# EAGLE design Adafruit Feather M4 Express (EAGLE 9.0.1)
COMPANY: ADAFRUIT INDUSTRIES; DRAWN: KTOWN; REV: B
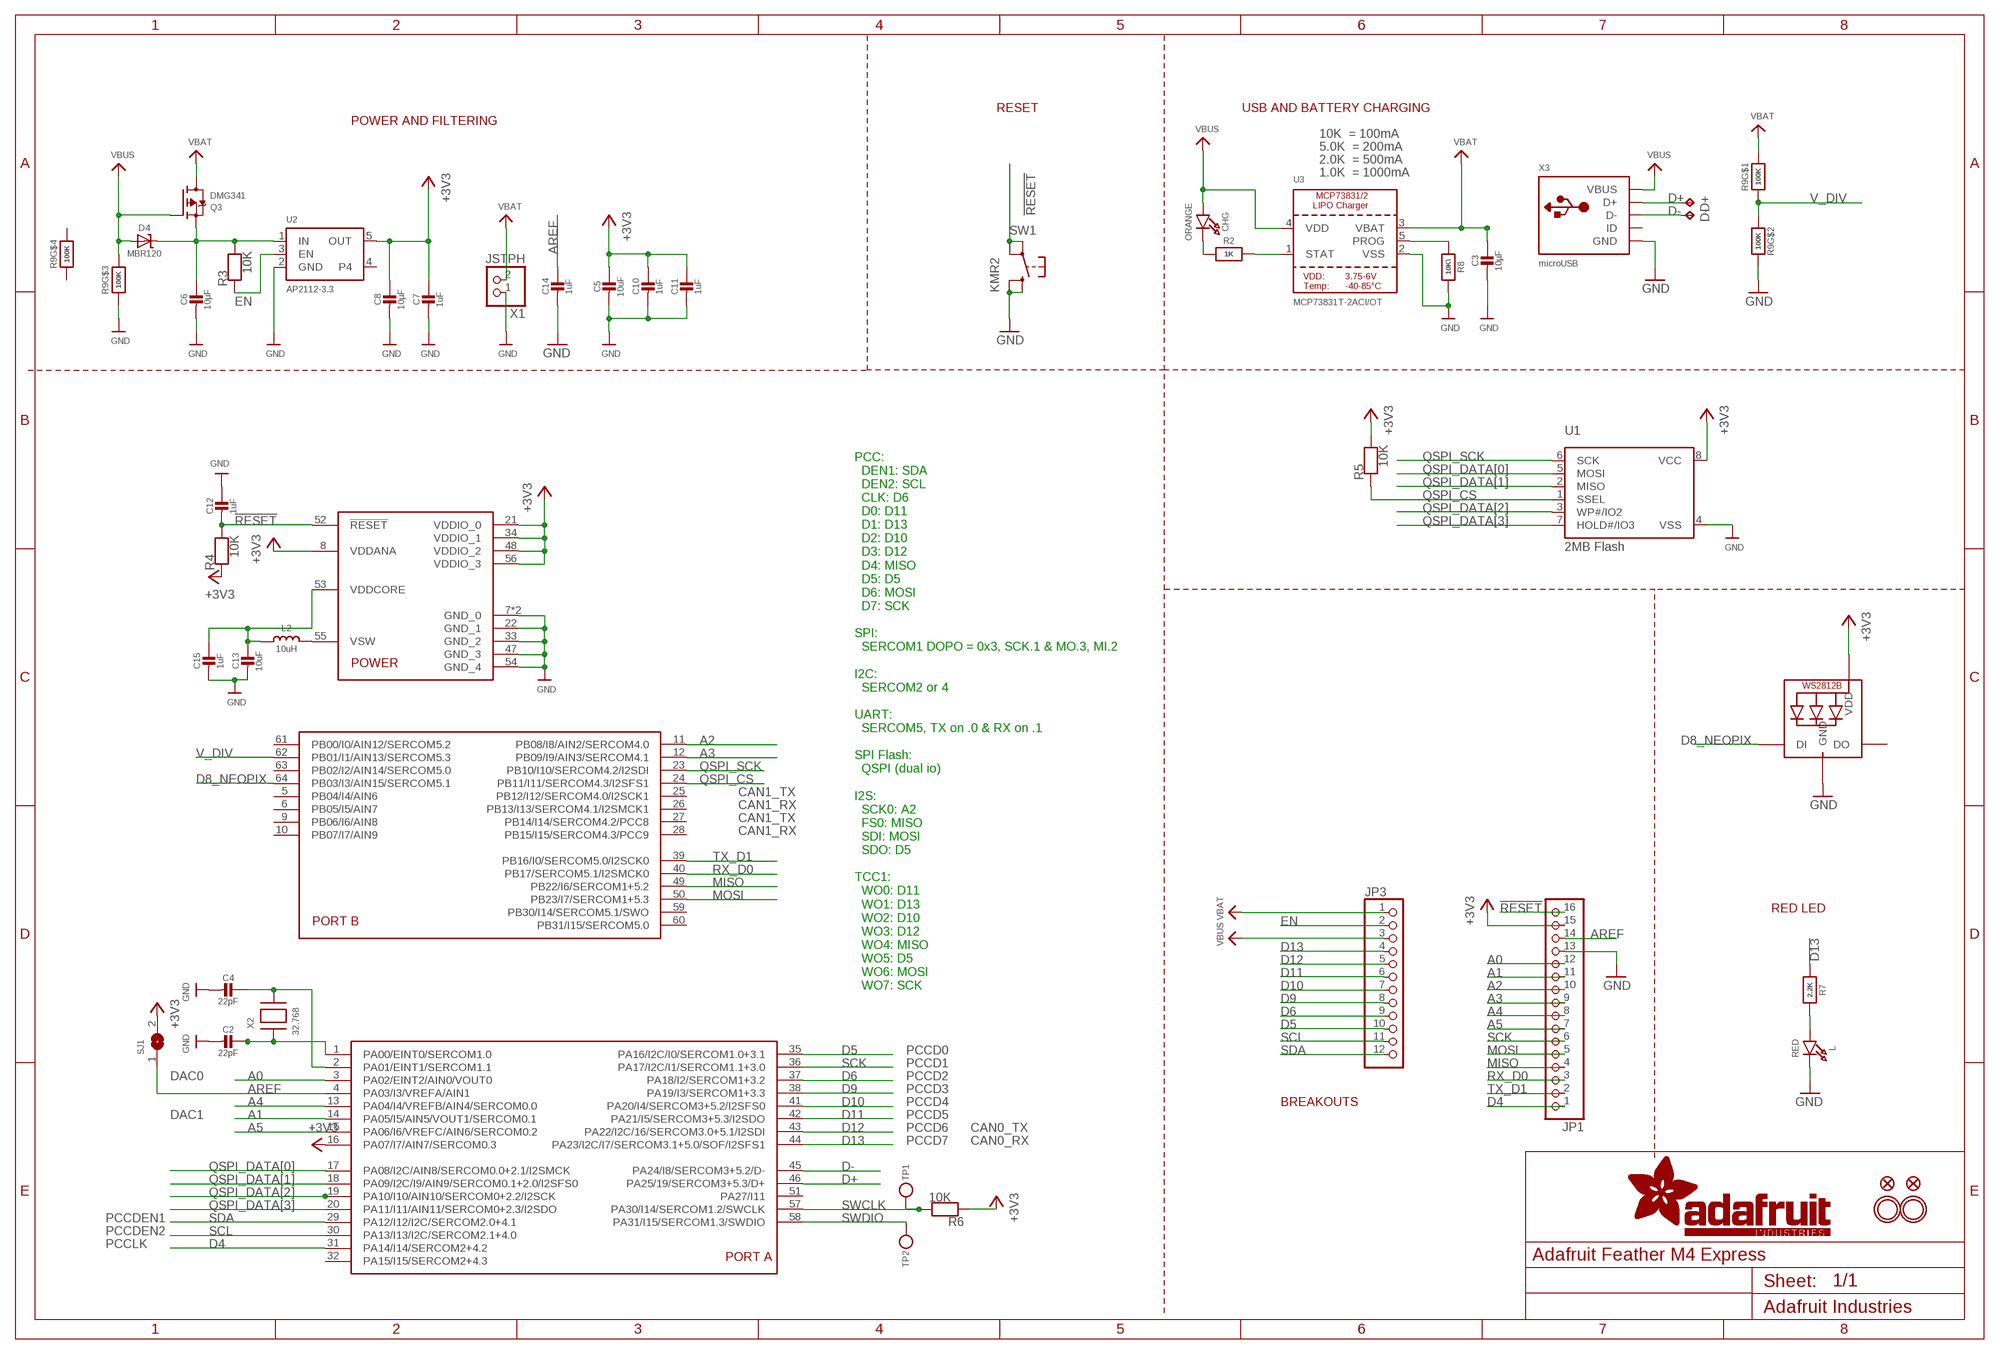
[diagram p0: schematic, sheet 1]

## Parts
C2  22pF  CAP_CERAMIC0603_NO  [0603-NO]
C3  10µF  CAP_CERAMIC0805-NOOUTLINE  [0805-NO]
C4  22pF  CAP_CERAMIC0603_NO  [0603-NO]
C5  10uF  CAP_CERAMIC0805-NOOUTLINE  [0805-NO]
C6  10µF  CAP_CERAMIC0805-NOOUTLINE  [0805-NO]
C7  1uF  CAP_CERAMIC0603_NO  [0603-NO]
C8  10µF  CAP_CERAMIC0805-NOOUTLINE  [0805-NO]
C10  1uF  CAP_CERAMIC0603_NO  [0603-NO]
C11  1uF  CAP_CERAMIC0603_NO  [0603-NO]
C12  1uF  CAP_CERAMIC0603_NO  [0603-NO]
C13  10uF  CAP_CERAMIC0805-NOOUTLINE  [0805-NO]
C14  1uF  CAP_CERAMIC0603_NO  [0603-NO]
C15  1uF  CAP_CERAMIC0603_NO  [0603-NO]
CHG  ORANGE  LED0805_NOOUTLINE  [CHIPLED_0805_NOOUTLINE]
D4  MBR120  DIODE-SCHOTTKYSOD-123  [SOD-123]
D+  TPB1,27  [B1,27]
D-  TPB1,27  [B1,27]
JP1  HEADER-1X16ROUND  [1X16_ROUND]
JP3  HEADER-1X12  [1X12_ROUND]
L  RED  LED0805_NOOUTLINE  [CHIPLED_0805_NOOUTLINE]
L2  10uH  INDUCTOR  [INDUCTOR_1007]
LED1  WS2812B3535  [LED3535]
Q3  DMG341  MOSFET-P  [SOT23-R]
R2  1K  RESISTOR_0603_NOOUT  [0603-NO]
R3  10K  RESISTOR_0603_NOOUT  [0603-NO]
R4  10K  RESISTOR_0603_NOOUT  [0603-NO]
R5  10K  RESISTOR_0603_NOOUT  [0603-NO]
R6  10K  RESISTOR_0603_NOOUT  [0603-NO]
R7  2.2K  RESISTOR_0603_NOOUT  [0603-NO]
R8  10K\  RESISTOR_0603_NOOUT  [0603-NO]
R9  100K  RESISTOR_4PACK_NO  [RESPACK_4X0603_NO]
SJ1  SOLDERJUMPERCLOSED  [SOLDERJUMPER_CLOSEDWIRE]
SW1  KMR2  SWITCH_TACT_SMT4.6X2.8  [BTN_KMR2_4.6X2.8]
TP1  TESTPOINTROUND1.5MM  [TESTPOINT_ROUND_1.5MM]
TP2  TESTPOINTROUND1.5MM  [TESTPOINT_ROUND_1.5MM]
U1  2MB Flash  SPIFLASH_8PINUX  [USON8]
U2  AP2112-3.3  VREG_SOT23-5  [SOT23-5]
U3  MCP73831T-2ACI/OT  MCP73831/2  [SOT23-5]
U$14  ATSAMD51J  [PQFN64-1]
U$31  MOUNTINGHOLE2.5  [MOUNTINGHOLE_2.5_PLATED]
U$32  MOUNTINGHOLE2.5  [MOUNTINGHOLE_2.5_PLATED]
U$34  FIDUCIAL_1MM  [FIDUCIAL_1MM]
U$35  FIDUCIAL_1MM  [FIDUCIAL_1MM]
X1  JSTPH  CON_JST_PH_2PIN  [JSTPH2]
X2  32.768  XTAL-3.2X1.5  [XTAL3215]
X3  microUSB  USB_MICRO_20329_V2  [4UCONN_20329_V2]

## Nets
!RESET: C12.2 JP1.16 R4.2 SW1.A'(P1) SW1.A(P) U$14.52(!RESET)
+3V3 [power]: C5.1 C7.1 C8.1 C10.1 C11.1 JP1.15 LED1.2(VDD) R4.1 R5.2 R6.1 SJ1.2 U1.8(VCC) U2.5(OUT) U$14.8(VDDANA) U$14.16(PA07/I7/AIN7/SERCOM0.3) U$14.21(VDDIO_0) U$14.34(VDDIO_1) U$14.48(VDDIO_2) U$14.56(VDDIO_3)
A0: JP1.12 U$14.3(PA02/EINT2/AIN0/VOUT0)
A1: JP1.11 U$14.14(PA05/I5/AIN5/VOUT1/SERCOM0.1)
A2: JP1.10 U$14.11(PB08/I8/AIN2/SERCOM4.0)
A3: JP1.9 U$14.12(PB09/I9/AIN3/SERCOM4.1)
A4: JP1.8 U$14.13(PA04/I4/VREFB/AIN4/SERCOM0.0)
A5: JP1.7 U$14.15(PA06/I6/VREFC/AIN6/SERCOM0.2)
AREF: C14.1 JP1.14 SJ1.1 U$14.4(PA03/I3/VREFA/AIN1)
D4: JP1.1 U$14.31(PA14/I14/SERCOM2+4.2)
D5: JP3.10 U$14.35(PA16/I2C/I0/SERCOM1.0+3.1)
D6: JP3.9 U$14.37(PA18/I2/SERCOM1+3.2)
D8_NEOPIX: LED1.1(DI) U$14.64(PB03/I3/AIN15/SERCOM5.1)
D9: JP3.8 U$14.38(PA19/I3/SERCOM1+3.3)
D10: JP3.7 U$14.41(PA20/I4/SERCOM3+5.2/I2SFS0)
D11: JP3.6 U$14.42(PA21/I5/SERCOM3+5.3/I2SDO)
D12: JP3.5 U$14.43(PA22/I2C/16/SERCOM3.0+5.1/I2SDI)
D13: JP3.4 R7.1 U$14.44(PA23/I2C/I7/SERCOM3.1+5.0/SOF/I2SFS1)
D+: D+.TP U$14.46(PA25/19/SERCOM3+5.3/D+) X3.D+
D-: D-.TP U$14.45(PA24/I8/SERCOM3+5.2/D-) X3.D-
EN: JP3.2 R3.1 U2.3(EN)
GND [gnd]: C2.2 C3.2 C4.2 C5.2 C6.2 C7.2 C8.2 C10.2 C11.2 C12.1 C13.2 C14.2 C15.2 JP1.13 L.C LED1.4(GND) R8.2 R9.3 R9.7 SW1.B'(S1) SW1.B(S) U1.4(VSS) U2.2(GND) U3.2(VSS) U$14.7(GND_0) U$14.22(GND_1) U$14.33(GND_2) U$14.47(GND_3) U$14.54(GND_4) U$14.EXP(GND_0) X1.1 X3.BASE@1(GND) X3.BASE@2(GND) X3.GND X3.SPRT@1(GND) X3.SPRT@2(GND) X3.SPRT@3(GND) X3.SPRT@4(GND)
MISO: JP1.4 U$14.49(PB22/I6/SERCOM1+5.2)
MOSI: JP1.5 U$14.50(PB23/I7/SERCOM1+5.3)
N$1: CHG.C R2.1
N$2: L.A R7.2
N$3: R2.2 U3.1(STAT)
N$4: R8.1 U3.5(PROG)
N$5: C2.1 U$14.1(PA00/EINT0/SERCOM1.0) X2.P$1
N$7: C4.1 U$14.2(PA01/EINT1/SERCOM1.1) X2.P$2
N$11: L2.P$2 U$14.55(VSW)
QSPI_CS: R5.1 U1.1(SSEL) U$14.24(PB11/I11/SERCOM4.3/I2SFS1)
QSPI_DATA[0]: U1.5(MOSI) U$14.17(PA08/I2C/AIN8/SERCOM0.0+2.1/I2SMCK)
QSPI_DATA[1]: U1.2(MISO) U$14.18(PA09/I2C/I9/AIN9/SERCOM0.1+2.0/I2SFS0)
QSPI_DATA[2]: U1.3(WP#/IO2) U$14.19(PA10/I10/AIN10/SERCOM0+2.2/I2SCK)
QSPI_DATA[3]: U1.7(HOLD#/IO3) U$14.20(PA11/I11/AIN11/SERCOM0+2.3/I2SDO)
QSPI_SCK: U1.6(SCK) U$14.23(PB10/I10/SERCOM4.2/I2SDI)
RX_D0: JP1.3 U$14.40(PB17/SERCOM5.1/I2SMCK0)
SCK: JP1.6 U$14.36(PA17/I2C/I1/SERCOM1.1+3.0)
SCL: JP3.11 U$14.30(PA13/I13/I2C/SERCOM2.1+4.0)
SDA: JP3.12 U$14.29(PA12/I12/I2C/SERCOM2.0+4.1)
SWCLK: R6.2 TP1.P$1 U$14.57(PA30/I14/SERCOM1.2/SWCLK)
SWDIO: TP2.P$1 U$14.58(PA31/I15/SERCOM1.3/SWDIO)
TX_D1: JP1.2 U$14.39(PB16/I0/SERCOM5.0/I2SCK0)
V_DIV: R9.1 R9.2 U$14.62(PB01/I1/AIN13/SERCOM5.3)
VBAT [power]: C3.1 JP3.1 Q3.3(D) R9.8 U3.3(VBAT) X1.2
VBUS [power]: CHG.A D4.A JP3.3 Q3.1(G) R9.6 U3.4(VDD) X3.VBUS
VDDCORE1: C13.1 C15.1 L2.P$1 U$14.53(VDDCORE)
VHI: C6.1 D4.C Q3.2(S) R3.2 U2.1(IN)
Unconnected: LED1.3(DO) R9.4 R9.5 U2.4 U$14.5(PB04/I4/AIN6) U$14.6(PB05/I5/AIN7) U$14.9(PB06/I6/AIN8) U$14.10(PB07/I7/AIN9) U$14.25(PB12/I12/SERCOM4.0/I2SCK1) U$14.26(PB13/I13/SERCOM4.1/I2SMCK1) U$14.27(PB14/I14/SERCOM4.2/PCC8) U$14.28(PB15/I15/SERCOM4.3/PCC9) U$14.32(PA15/I15/SERCOM2+4.3) U$14.51(PA27/I11) U$14.59(PB30/I14/SERCOM5.1/SWO) U$14.60(PB31/I15/SERCOM5.0) U$14.61(PB00/I0/AIN12/SERCOM5.2) U$14.63(PB02/I2/AIN14/SERCOM5.0) X3.ID

## Notes on the sheet
- RESET | USB AND BATTERY CHARGING
- POWER AND FILTERING
- 10K  = 100mA
- 5.0K  = 200mA
- 2.0K  = 500mA
- 1.0K  = 1000mA
- CAN1_TX
- CAN1_RX
- CAN1_TX
- CAN1_RX
- RED LED
- PCC:
    DEN1: SDA
    DEN2: SCL
    CLK: D6
    D0: D11
    D1: D13
    D2: D10
    D3: D12
    D4: MISO
    D5: D5
    D6: MOSI
    D7: SCK
  
  SPI:
    SERCOM1 DOPO = 0x3, SCK.1 & MO.3, MI.2
  
  I2C:
    SERCOM2 or 4
  
  UART:
    SERCOM5, TX on .0 & RX on .1
  
  SPI Flash:
    QSPI (dual io)
  
  I2S:
    SCK0: A2
    FS0: MISO
    SDI: MOSI
    SDO: D5
  
  TCC1:
    WO0: D11
    WO1: D13
    WO2: D10
    WO3: D12
    WO4: MISO
    WO5: D5
    WO6: MOSI
    WO7: SCK
- PCCD0
- PCCD1
- DAC0 | PCCD2
- PCCD3
- PCCD4 | BREAKOUTS
- DAC1 | PCCD5
- PCCD6 | CAN0_TX
- PCCD7 | CAN0_RX
- PCCDEN1
- PCCDEN2
- PCCLK

## Library data of the parts
C2-C8 C10-C15 = microbuilder:CAP_CERAMIC: Ceramic Capacitors For new designs, use the packages preceded by an '_' character since they are more reliable: The following footprints should be used on most boards: _0402 - Standard footprint for regular board layouts _0603 - Standard footprint for regular board layouts _0805 - Standard footprint for regular board layouts _1206 - Standard footprint for regular board layouts For extremely tight-pitch boards where space is at a premium, the following 'micro-pitch' footprints can be used (smaller pads, no silkscreen outline, etc.): _0402MP - Micro-pitch footprint for very dense/compact boards _0603MP - Micro-pitch footprint for very dense/compact boards _0805MP - Micro-pitch footprint for very dense/compact boards _1206MP - Micro-pitch footprint for very dense/compact boards
CHG L = microbuilder:LED: LED 0603 - 0603 Surface Mount Package 2mA: Green LED - Low Power (3.9mcd, 2ma, 1.7Vf) - Digikey: 475-2709-2-ND Orange LED - Low Power (9.8mcd, 2ma, 1.8Vf) - Digikey: 475-1194-2-ND Red LED - Low Power (5mcd, 2ma, 1.8Vf) - Digikey: 475-1195-2-ND Yellow LED - Low Power (7mcd, 2ma, 1.8Vf) - Digikey: 475-1196-2-ND 5mA: Blue LED - Low Power (17mcd, 5ma, 2.9Vf) - Digikey: LNJ937W8CRACT-ND 0805 - 0805 Surface Mount Package 2mA: Red LED (8.8mcd, 2mA, 1.8Vf, Clear) - Low Power [Digikey: 475-2510-1-ND] Green LED (5mcd, 2mA, 1.8Vf, Clear) - Low Power [Digikey: 475-2730-1-ND] Yellow LED (11.3mcd, 2mA, 1.8Vf, Clear) - Low Power [Digikey: 475-2555-1-ND] 20mA: Red LED (104mcd, 20mA, Diffused) - LS R976 [Digikey: 475-1278-6-ND] Red LED (12mcd, 20mA, 2.0Vf, Clear) - APT2012EC [Digikey: 754-1128-1-ND] Green LED (15mcd, 20mA, 2.2Vf, Clear) - APT2012GC [Digikey: 754-1131-1-ND] Orange LED (160mcd, 20mA, 2.1Vf, Clear) - APT2012SECK [Digikey: 754-1130-1-ND] 1206 - 1206 Surface Mount Package Green LED (26mcd, 20mA, Diffused) - LG N971 [Digikey: 475-1407-6-ND] Red LED (15mcd, 20mA, Diffused) - LH N974 [Digikey: 475-1416-6-ND] Cree - Cree High-Power Surface Mount LEDs XPEBWT-L1-0000-00D50 - White 111lm 350mA 2.9Vf 6200K 110° XTEAWT-00-0000-00000LEE3 - White 114lm 350mA 2.85Vf 5000K 115° Everlight - Everlight 45-21 Series Surface Mount LEDs 45-21/QK2C-B2832AC2CB2/2T - Warm White 2000mcd 20mA 3.25Vf 3050K 120° 45-21/LK2C-B38452C4CB2/2T - Nuetral White 2000mcd 20mA 3.25Vf 4150K 120° 45-21/LK2C-B50634C6CB2/2T - Cold White 2200mcd 20mA 3.25Vf 5650K 120° PLCC2 Reverse Mount LS T77K-J1L2-1-0-2-R18-Z - Red 11.25mcd 2mA 1.8Vf 630nm 120° LO T77K-L1M2-24-Z - Orange 19.6mcd 2mA 1.8Vf 606nm 120° LY T77K-K2M1-26-Z - Yellow 15.7mcd 2mA 1.8Vf 587nm 120°
D4 = microbuilder:DIODE-SCHOTTKY
D+ D- = testpad:TP: Test pad
JP1 = microbuilder:HEADER-1X16: PIN HEADER
JP3 = microbuilder:HEADER-1X12
L2 = microbuilder:INDUCTOR: Inductors 0603: 10nH Ceramic Inductor - microwire antenna/RF (Digikey: 712-1434-2-ND) 0805: 560nH Ceramic Inductor - RF (Digikey: 553-1047-1-ND) 270nH Ceramic Inductor - Q = 40@250MHz, +-5%, 1 Ohm DC Resistance (Digikey: 535-10506-2-ND) 1007 (2518 Metric) SMT: 10µH 10% 250mOhm 820mA 1007 Inductor (Digikey: 587-2189-1-ND) 22µH 10% 500mOhm 580mA 1007 Inductor (Digikey: 587-2190-1-ND) 47µH 10% 950mOhm 420mA 1007 Inductor (Digikey: 587-2191-1-ND) 47µH 5% 100mOhm 1A 1008 Inductor (Digikey: 732-1816-1-ND) 5.0x5.0mm (Taiyo Yuden NR5040 Series) 6.8µH 20% 2.3A 64mOhm Inductor (Digikey: 587-2374-2-ND) 5.0x5.0mm (TDK VLC5045 Series) 4.7µH 20% 3.3A 34mOhm Inductor (Digikey: 445-6526-1-ND) 6.8µH 20% 2.7A 46mOhm Inductor (Digikey: 445-6527-1-ND) 6.0x6.0mm (TDK VLC6045 Series) 4.7µH 20% 3.8A 27mOhm Inductor (Digikey: 445-6538-2-ND) 6.8µH 20% 3A 41mOhm Inductor (Digikey: 445-6540-1-ND) 6.2µH 30% 2.2A 45mOhm Inductor (Digikey: SRR5028-6R2YCT-ND) - Not TDK VLC6045 but footprint should match 6.0x6.0mm (TDK SLF6045 Series) 6.8uH 30% 2A 33mOhm Inductor (Digikey: 445-4572-1-ND, Mouser: 810-SLF645T6R8N2R0PF) 6.0x6.0mm (Sumida CDRH5D28 Series) 6.2uH 30% 1.8A 45mOhm Inductor (Digikey: 308-1542-1-ND) Taiyo Yuden NR3015T2R2M - 2.2uH 20% 1.5A (Digikey: 587-1648-2-ND, Mouser: 963-NR3015T2R2M) - Used with TI TPS62172 CoilCraft RFID Transponder Coil - MA5532-AE (For use with AS3935 Lightning Sensor) Taiyo Yuden NRH2412T2R2MNGH - 2.2uH 20% 1AA (Digikey: 587-3443-1-ND) - Used with TI LM3671 Vishay IHLP 1.0uH Molded Inductor - 24mOhm DCR, 5A, +/-20%, -55°C-125°C (Digikey: 541-1319-1-ND)
LED1 = microbuilder:WS2812B
Q3 = microbuilder:MOSFET-P: P-Channel Mosfet LEGEND VDS: Voltage Drain-Source ID: Drain Current RDS(ON): Drain-Source On-State Resistance VGS(TH): Gate-Source Threshold Voltage CISS: Drain-Source Input Capacitance SOT-23 Name VDS ID RDS(ON) VGS(TH) CISS Order Number IRLML5103 30V 760mA 600 mOhm -- 75pF @ 25V Digikey: IRLML5103PBFCT-ND IRLML6401 12V 4.3A 50 mOhm 950mV @ 250µA 830pF @ 10V Digikey: IRLML6401PBFTR-ND NTR0202PL 20V 400mA 800 mOhm 2.3V @ 250uA 70pF @ 5V Digikey: NTR0202PLT1GOSTR-ND NTR4101PT1G 20V 1.8A 85 mOhm 1.2V @ 250uA 675pF @ 10V Digikey: NTR4101PT1GOSCT-ND DMP2004K 20V 600mA 900 mOhm 1V @ 250uA 175pF @ 16V Digikey: DMP2004KDICT-ND PMV65XP 20V 3.9A 76 mOhm 950mV @ 1mA 725pF @ 20V Digikey: 568-2358-2-ND TO-252 Name VDS ID RDS(ON) VGS(TH) CISS Order Number AOD417 30V 25A 34 mOhm 3V @ 250µA 920pF @ 15V Digikey: 785-1106-2-ND PowerPak Name VDS ID RDS(ON) VGS(TH) CISS Order Number AON7401 30V 12A 14 mOhm 3V @ 250µA 2600pF @ 15V Digikey: 785-1302-1-ND
R2-R8 = microbuilder:RESISTOR: Resistors For new designs, use the packages preceded by an '_' character since they are more reliable: The following footprints should be used on most boards: _0402 - Standard footprint for regular board layouts _0603 - Standard footprint for regular board layouts _0805 - Standard footprint for regular board layouts _1206 - Standard footprint for regular board layouts For extremely tight-pitch boards where space is at a premium, the following 'micro-pitch' footprints can be used (smaller pads, no silkscreen outline, etc.): _0402MP - Micro-pitch footprint for very dense/compact boards _0603MP - Micro-pitch footprint for very dense/compact boards _0805MP - Micro-pitch footprint for very dense/compact boards _1206MP - Micro-pitch footprint for very dense/compact boards
R9 = microbuilder:RESISTOR_4PACK: Resistor Packs (4 resistors) 4 x 0603 10K 1/16W - Digikey: YC164J-10KCT-ND
SJ1 = microbuilder:SOLDERJUMPER: SMD Solder JUMPER Solder the two pads together to create a connection, or remove the solder to break it. REFLOW - Use this footprint for solder paste and reflow ovens. WAVE - Use this footprint for hand-soldering (larger pads). CLOSED - Has a trace between the two pads to ensure it is closed by default. The trace needs to be cut to disable the jumper, and can be closed again by creating a solder bridge between the two pads.
SW1 = microbuilder:SWITCH_TACT_SMT: SMT Tact Switches 6x6mm - Digikey: P12940SCT-ND KMR2 (4.6x2.8mm) - Digikey: 401-1426-1-ND EVQ-PQHB55 - Light Touch, 160GF (4.5x4.5mm) - Digikey: P8090SCT-ND KMT0 - KMT021 NGJ LHS (etc.) IP68/Waterproof - Digikey: CKN10289CT-ND
TP1 TP2 = microbuilder:TESTPOINT: Test Point Various test points for characterisation and PCB testing TESTPOINT_SMT - Compact Surface Mount Test Point [Digikey: 5016KTR-ND]
U1 = microbuilder:SPIFLASH_8PIN: SOIC8 SPI Flash Be careful with the size since SOIC8 flash comes in several 'widths' SOIC8 150 mil M25P16 - 16Mbit (2Mbit x 8) Serial Flash (75MHz SPI Bus), Supply: 2.7-3.6V Digikey: SOIC8 - M25P16-VMN6P-ND SOIC8 208 mil W25Q16BVSSIG - 16Mbit (2Mbit x 8) Serial Flash (104MHz SPI Bus), Supply: 2.7-3.6V Digikey: SOIC8 - W25Q16BVSSIG-ND
U2 = microbuilder:VREG_SOT23-5: SOT23-5 Fixed Voltage Regulators Part Current Out V Out V In V Dropout θJA (°C/W) TJ (°C) Digikey Part No. ADP121 150mA 3.3V 3.4-5.5V 0.09V @ 150mA -- -- ADP121-AUJZ33R7CT-ND ADP121 150mA 3.0V 3.1-5.5V 0.09V @ 150mA -- -- ADP121-AUJZ30R7CT-ND ADP122 300mA 3.3V 3.4-5.5V 0.085V @ 300mA -- -- ADP122AUJZ-3.3-R7CT-ND ADP1712 300mA 3.3V 3.5-5.5V 0.17V @ 300mA -- -- ADP1712AUJZ-3.3-R7TR-ND AP7311 (Low Cost) 150mA 3.3V 3.5-6V 0.15V @ 150mA -- -- AP7311-33WG-7DICT-ND LD39015M18R 150mA 1.8V 1.9V-5.5V 0.08V @ 100mA -- -- 497-6977-1-ND LP2985A-33DBVR 150mA 3.3V 3.3-16V 0.28V @ 150mA 206 150 296-18479-1-ND MCP1824T-3302E/OT 300mA 3.3V 3.5V-6V 0.2V @ 300mA -- -- MCP1824T-3302E/OTCT-ND MIC5205-2.5YM5 TR 150mA 2.5V 2.7-16V 0.165V @ 150mA -- -- 576-1257-2-ND MIC5205-3.0YM5 TR 150mA 3.0V 3.2V-16V 0.165V @ 150mA -- -- 576-1258-2-ND MIC5205-3.3YM5 TR 150mA 3.3V 3.5V-16V 0.165V @ 150mA -- -- 576-1259-2-ND TPS780330220 150mA 3.3V+2.2V 3.6-5.5V 250mV Max -- -- 296-23332-1-ND TDA3663/N1,135 100mA 3.3V 3.5-45V 0.18V @ 50mA -- -- 568-5343-1-ND Max operating temp can be calculated using θJA, TJ (max junction temperature), and power in watts. Set the "Maximum Ambient Temperature" until it reaches TJ ("Max Junction Temperature"), which is the absolute limit for safe use of the regulator: Heat Sink Temperature Calculator <http://www.daycounter.com/Calculators/Heat-Sink-Temperature-Calculator.phtml> For example, With 12V source into a 3.3V LP2985 and a 30mA load, we are dissipating (12V-3.3V) * 0.03A = 0.261W. With a θJA of 206 °C/W, a TJ of 150°C, and 261mW we can safely use the chip without a heat sink up to 75°C (=147.1°C Junction Temperature).
U3 = microbuilder:MCP73831/2: MCP73831/2 LIPO Charger VDD: 3.75 - 6V Temp -40 - 85°C Programmable Charge Rate: 15-500mA NOTE: STAT is a tri-state logic output on the MCP73831 and an open-drain output on the MCP73832. SOT23-5 with 4.2V output and tri-state logic on STAT = MCP73831T-2ACI/OT
U$14 = microbuilder:ATSAMD51J: ATSAMD51J cortex m4 microcontroller
U$31 U$32 = microbuilder:MOUNTINGHOLE: Mounting Hole For #2 screws (0.086"/2.18mm width, 0.094"/2.4mm hole) use 2.5mm; BOM: EXCLUDE
U$34 U$35 = microbuilder:FIDUCIAL: Fiducial Alignment Points Various fiducial points for machine vision alignment.; BOM: EXCLUDE
X1 = microbuilder:CON_JST_PH_2PIN: JST 2-Pin Right-Angle Connector PH-Series - 4UConnector: 17311 SH-Series - 4UConnector: 07278
X2 = adafruit2:XTAL: Low cost SMT crystals, no capacitors included http://www.ladyada.net/library/eagle
X3 = microbuilder:USB: USB Connectors USBMINIB - Surface Mount Female Mini-B USB Connector 4UConnector: 06564

## Net classes
1 power: width 0.305 mm
2 gnd: width 0.254 mm

## Board
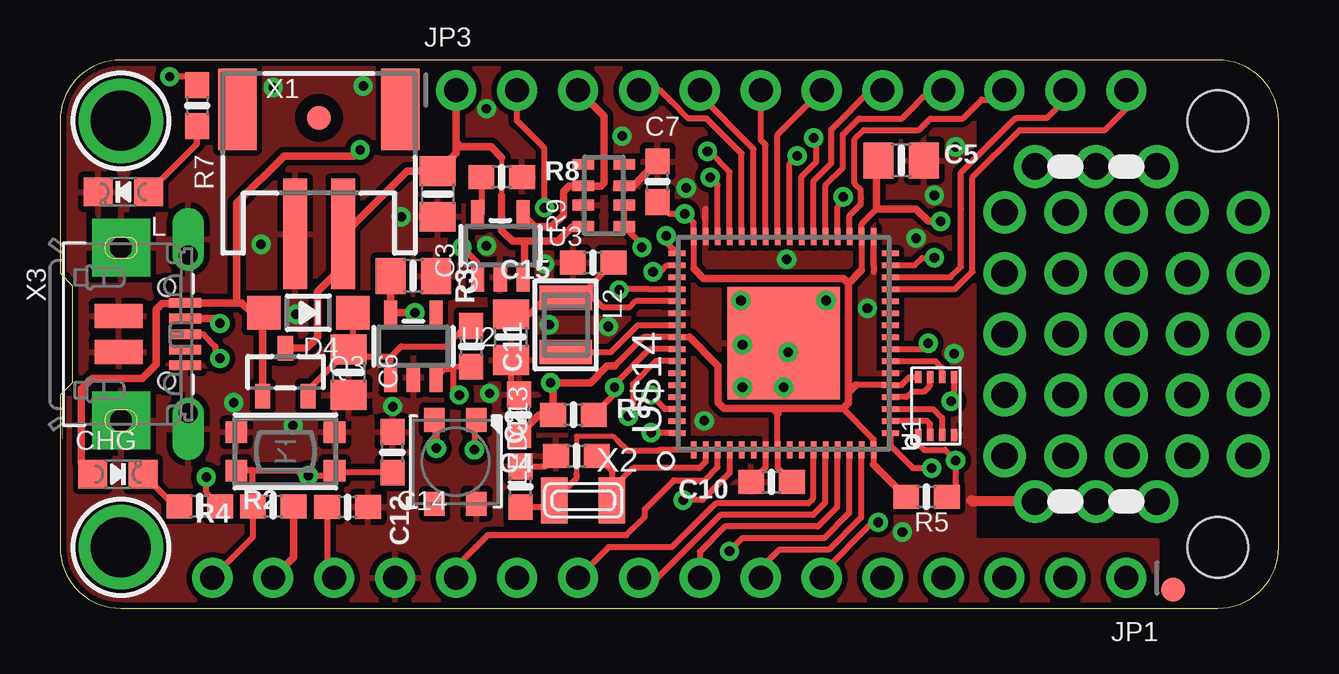
[diagram p1: board, top side]
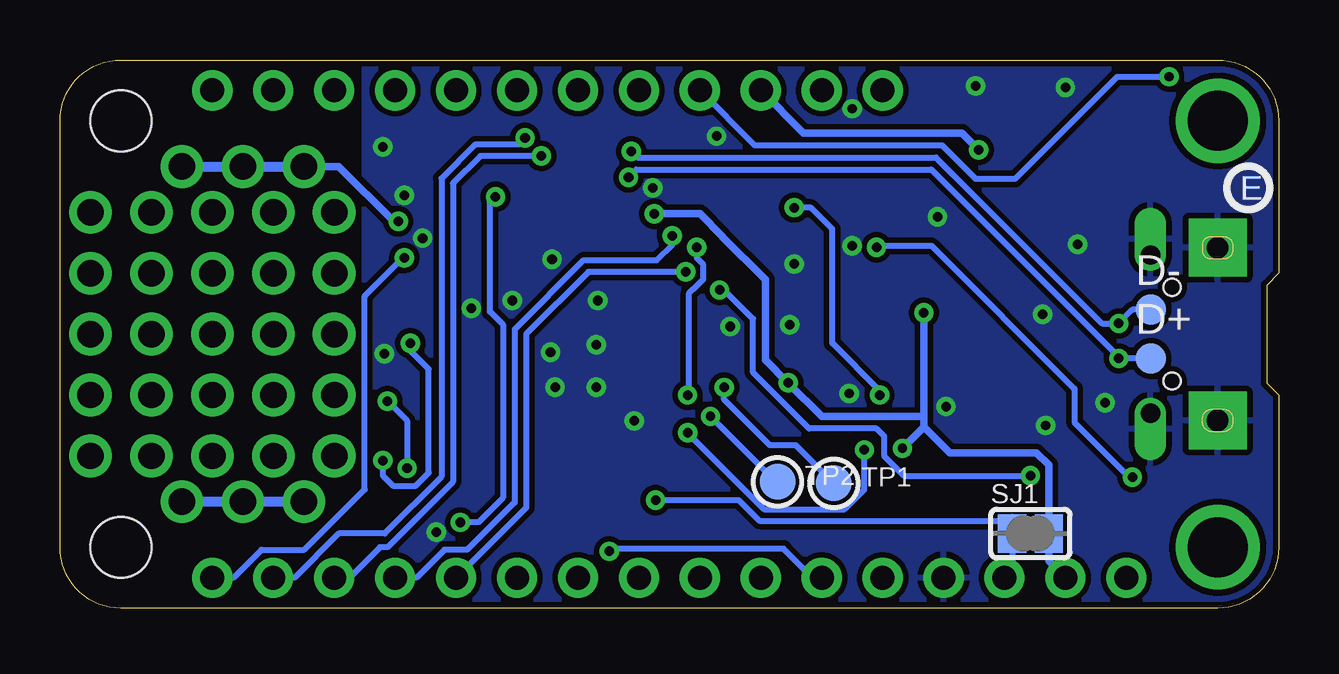
[diagram p2: board, bottom side, seen from below]

Size 50.8 x 22.86 mm. Coordinates in mm from the lower left corner, seen from the top.
Outline: 2.54,0 48.26,0 arc90 50.8,2.54 50.8,20.32 arc90 48.26,22.86 2.54,22.86 arc90 0,20.32 0,13.97 0.51,13.46 0.51,9.4 0,8.89 0,2.54 arc90 2.54,0
Copper layers (1*16): Top 0.035mm / dielectric 1.5mm / Bottom 0.035mm
Design rules "adafruit *": minimum track width 8mil, minimum drill 15.5mil, track to track 9mil, track to pad 8mil, pad to pad 8mil, via to via 8mil, smd to smd 8mil, copper to edge 10mil, drill to drill 8mil, minimum pad ring 10mil, minimum via ring 8mil, stop-mask expansion 2mil, vias tented up to drill 20mil, thermal gap 10mil
Holes 2.54 mm at 48.26,20.32 48.26,2.54

### Footprints (pad centres in the part's own frame; a part is rotated, then mirrored left to right if it is on the bottom)
0603-NO = smd 1.075 x 1: 1 -0.85,0; 2 0.85,0
0805-NO = smd 1.24 x 1.5: 1 -0.95,0; 2 0.95,0
CHIPLED_0805_NOOUTLINE = smd 1.2 x 1.2: A 0,-1.05; C 0,1.05
SOD-123 = smd 1.4 x 1.4: A 1.85,0; C -1.85,0
B1,27 = smd 1.27 x 1.27: TP 0,0
1X16_ROUND = drill 1 pad 1.676: 1 -19.05,0; 2 -16.51,0; 3 -13.97,0; 4 -11.43,0; 5 -8.89,0; 6 -6.35,0; 7 -3.81,0; 8 -1.27,0; 9 1.27,0; 10 3.81,0; 11 6.35,0; 12 8.89,0; 13 11.43,0; 14 13.97,0; 15 16.51,0; 16 19.05,0
1X12_ROUND = drill 1 pad 1.676: 1 -13.97,0; 2 -11.43,0; 3 -8.89,0; 4 -6.35,0; 5 -3.81,0; 6 -1.27,0; 7 1.27,0; 8 3.81,0; 9 6.35,0; 10 8.89,0; 11 11.43,0; 12 13.97,0
INDUCTOR_1007 = smd 1.016 x 2.2: P$1 -1.127,0; P$2 1.127,0
LED3535 = smd 1 x 0.85: 1 -1.75,0.875; 2 -1.75,-0.875; 3 1.75,-0.875; 4 1.75,0.875
SOT23-R = smd 0.635 x 1.016: 1 -0.95,-1; 2 0.95,-1; 3 0,1
RESPACK_4X0603_NO = smd 0.45 x 0.9: 1 -1.3,-0.85; 2 -0.4,-0.85; 3 0.4,-0.85; 4 1.3,-0.85; 5 1.3,0.85; 6 0.4,0.85; 7 -0.4,0.85; 8 -1.3,0.85
SOLDERJUMPER_CLOSEDWIRE = smd 1.168 x 1.6: 1 -0.762,0; 2 0.762,0 | smd 0.635 x 0.203: WIRE 0,0
BTN_KMR2_4.6X2.8 = smd 0.9 x 0.9: A 2.05,0.8; A' -2.05,0.8; B 2.05,-0.8; B' -2.05,-0.8
TESTPOINT_ROUND_1.5MM = smd 1.5 x 1.5: P$1 0,0
USON8 = smd 0.5 x 0.275: 1 -1.2,0.75; 2 -1.2,0.25; 3 -1.2,-0.25; 4 -1.2,-0.75; 5 1.2,-0.75; 6 1.2,-0.25; 7 1.2,0.25; 8 1.2,0.75
SOT23-5 = smd 0.55 x 1.2: 1 -0.95,-1.3; 2 0,-1.3; 3 0.95,-1.3; 4 0.95,1.3; 5 -0.95,1.3
PQFN64-1 = smd 0.7 x 0.22: 1 -4.45,3.75; 2 -4.45,3.25; 3 -4.45,2.75; 4 -4.45,2.25; 5 -4.45,1.75; 6 -4.45,1.25; 7 -4.45,0.75; 8 -4.45,0.25; 9 -4.45,-0.25; 10 -4.45,-0.75; 11 -4.45,-1.25; 12 -4.45,-1.75; 13 -4.45,-2.25; 14 -4.45,-2.75; 15 -4.45,-3.25; 16 -4.45,-3.75; 33 4.45,-3.75; 34 4.45,-3.25; 35 4.45,-2.75; 36 4.45,-2.25; 37 4.45,-1.75; 38 4.45,-1.25; 39 4.45,-0.75; 40 4.45,-0.25; 41 4.45,0.25; 42 4.45,0.75; 43 4.45,1.25; 44 4.45,1.75; 45 4.45,2.25; 46 4.45,2.75; 47 4.45,3.25; 48 4.45,3.75 | smd 0.22 x 0.7: 17 -3.75,-4.45; 18 -3.25,-4.45; 19 -2.75,-4.45; 20 -2.25,-4.45; 21 -1.75,-4.45; 22 -1.25,-4.45; 23 -0.75,-4.45; 24 -0.25,-4.45; 25 0.25,-4.45; 26 0.75,-4.45; 27 1.25,-4.45; 28 1.75,-4.45; 29 2.25,-4.45; 30 2.75,-4.45; 31 3.25,-4.45; 32 3.75,-4.45; 49 3.75,4.45; 50 3.25,4.45; 51 2.75,4.45; 52 2.25,4.45; 53 1.75,4.45; 54 1.25,4.45; 55 0.75,4.45; 56 0.25,4.45; 57 -0.25,4.45; 58 -0.75,4.45; 59 -1.25,4.45; 60 -1.75,4.45; 61 -2.25,4.45; 62 -2.75,4.45; 63 -3.25,4.45; 64 -3.75,4.45 | smd 4.7 x 4.7: EXP 0,0
MOUNTINGHOLE_2.5_PLATED = drill 2.5 pad 3.2: P$1 0,0
FIDUCIAL_1MM = smd 1 x 1: 1 0,0
JSTPH2 = smd 1 x 4.6: 1 -1,-3.7; 2 1,-3.7 | smd 1.6 x 3.4: NC1 -3.4,1.5; NC2 3.4,1.5
XTAL3215 = smd 1.1 x 1.9: P$1 1.2,0; P$2 -1.2,0
4UCONN_20329_V2 = smd 1 x 2: BASE@1 -0.75,-2; BASE@2 0.75,-2 | smd 0.4 x 1.35: D+ 0,0.775; D- -0.65,0.775; GND 1.3,0.775; ID 0.65,0.775; VBUS -1.3,0.775 | drill 0.8 pad 1.143 offset: SPRT@1 -3.3,0.9; SPRT@2 3.3,0.9 | drill 0.9 pad 2.413 square: SPRT@3 -3.6,-1.9; SPRT@4 3.6,-1.9 | hole 0.7: -1.95,0; 1.95,0

### Placement (x,y rotation side)
C2  19.2,5.07 90 top
C3  15.75,17.27 270 top
C4  21.53,6.35 180 top
C5  35.06,18.67 0 top
C6  12.04,9.84 270 top
C7  24.91,17.78 90 top
C8  14.73,13.86 0 top
C10  29.66,5.26 180 top
C11  19.13,8.06 90 top
C12  13.86,6.5 270 top
C13  18.8,11.3 270 top
C14  11.99,4.22 0 top
C15  22.23,14.41 180 top
CHG  2.41,5.59 270 top
D4  10.35,12.32 180 top
D+  5.33,10.41 0 bottom
D-  5.33,12.45 0 bottom
JP1  25.4,1.27 180 top
JP3  30.48,21.59 0 top
L  2.65,17.36 90 top
L2  21.08,11.81 270 top
LED1  16.48,6.11 270 top
Q3  9.4,9.84 0 top
R2  5.83,4.25 0 top
R3  17.14,10.92 90 top
R4  8.89,4.25 180 top
R5  36.12,4.65 180 top
R6  21.4,8.06 0 top
R7  5.71,20.95 270 top
R8  18.41,17.97 0 top
R9  22.67,17.21 90 top
SJ1  10.35,3.11 0 bottom
SW1  9.4,6.54 180 top
TP1  18.54,5.21 0 bottom
TP2  20.89,5.27 0 bottom
U1  36.51,8.43 90 top
U2  14.73,10.92 0 top
U3  18.35,15.11 0 top
U$5  [FEATHERM4_BOT]  50.8,0 0 bottom
U$6  [FEATHERM4_TOP]  0,0 0 top
U$13  [PCBFEAT-REV-040]  1.27,17.53 0 bottom
U$14  30.16,11.05 90 top
U$31  2.54,20.32 270 top
U$32  2.54,2.54 270 top
U$34  10.79,20.45 270 top
U$35  46.4,0.77 270 top
X1  10.79,19.3 0 top
X2  21.81,4.5 180 top
X3  4.45,11.43 270 top

### Tracks (layer width: path | path; a pad name or v marks a point on that pad's centre or on a via)
!RESET  (via drill 0.39)
  Top 0.254: 8.06,5.74 9.88,5.74 10.1,5.52 v10.35,5.52 11.23,5.52 SW1.A' 11.54,5.65 C12.2 | 8.06,5.74 SW1.A | JP1.16 8.04,2.96 R4.2 8.04,5.72 8.06,5.74 | v23.3,13.27 23.33,13.3 24.53,13.3 24.54,13.29 25.15,13.29 25.16,13.3 U$14.52
  Bottom 0.254: v23.3,13.27 23.11,13.27 21.91,12.06 21.91,9.83 19.57,7.49 16.76,7.49 16.45,7.18 16.45,6.35 15.62,5.52 v10.35,5.52
+3V3  (via drill 0.39, 0.4, 1.1 pad 1.78)
  Top 0.254: 23.11,10.09 24.32,11.3 U$14.56 26.23,11.3 | 34.04,16.64 33.41,16.01 U$14.34 33.41,14.09 | 33.17,9.3 U$14.21 35.08,9.3 35.41,9.63 U1.8 | 26.42,14.16 26.42,15.06 26.41,15.06 U$14.48 26.41,16.07 v26.04,16.45 25.39,16.45 C7.1 | 29.91,8.11 U$14.8 29.91,5.86 C10.1 | 32.63,8.32 33.91,7.04 U$14.16 33.91,6
  Top 0.305: R4.1 9.74,2.12 JP1.15 | C8.1 U2.5 | U2.5 | v14.8,12.32 13.87,12.32 U2.5 | v15.68,6.67 15.68,7.78 LED1.2 | 23.11,10.09 22.81,10.09 22.12,9.4 v20.45,9.4 20.55,9.3 R6.1 19.98,8.06 C11.1 | C5.1 34.04,18.59 34.04,16.64 35.69,16.64 36.19,16.14 v36.7,16.14 | 26.23,11.3 27.43,10.1 27.43,8.57 27.69,8.32 29.72,8.32 | 29.72,8.32 29.92,8.12 29.91,8.11 | 32.87,8.99 32.87,8.55 32.63,8.32 29.72,8.32 | 33.17,9.3 32.87,8.99 | 32.87,13.55 32.87,8.99 | 33.41,14.09 32.87,13.55 | 32.87,13.55 32.66,13.76 26.82,13.76 26.42,14.16 | 33.91,6 R5.2
  Bottom 0.305: JP1.15 9.59,1.97 SJ1.2 9.59,5.97 10.1,6.48 13.72,6.48 14.8,7.56 | 15.49,6.48 v15.68,6.67 14.8,7.56 | v14.8,12.32 14.8,8 | 14.8,7.56 14.8,8 | 14.8,8 19.05,8 v20.45,9.4 21.4,10.35 21.4,13.71 23.18,15.48 23.18,15.49 24.13,16.45 v26.04,16.45 | v40.64,18.41 39.18,18.41 36.9,16.14 v36.7,16.14
  Bottom 0.406: v45.72,18.41 v43.18,18.41 v40.64,18.41
A0
  Top 0.254: U$14.3 27.41,5.89 26.86,5.33 25.59,5.33 24.38,4.13 24.38,3.81 23.62,3.05 17.84,3.05 16.51,1.71 JP1.12
A1  (via drill 0.4)
  Top 0.254: U$14.14 32.9,6.58 32.9,3.97 31.85,2.92 28.43,2.92 27.91,2.4 v27.91,2.37
  Bottom 0.254: JP1.11 19.43,1.27 20.64,2.48 27.8,2.48 v27.91,2.37
A2
  Top 0.254: JP1.10 22.86,2.54 25.5,2.54 27.32,4.37 31.19,4.37 31.38,4.56 31.38,6.57 U$14.11
A3
  Top 0.254: U$14.12 31.89,6.58 31.89,4.39 31.39,3.89 27.52,3.89 24.91,1.27 JP1.9
A4
  Top 0.254: U$14.13 32.4,6.58 32.4,5.08 32.4,4.21 31.59,3.4 27.72,3.4 26.67,2.35 JP1.8
A5
  Top 0.254: U$14.15 33.4,6.58 33.4,3.78 32.05,2.44 29.97,2.44 29.21,1.68 JP1.7
AREF  (via drill 0.39)
  Top 0.254: C14.1 11.14,1.56 JP1.14 | U$14.4 27.91,5.64 26.78,4.51 v25.97,4.51
  Bottom 0.254: JP1.14 11.11,1.59 SJ1.1 11.11,3.24 | 11.11,3.81 11.11,3.24 | v25.97,4.51 22.52,4.51 21.65,3.64 11.52,3.64 11.11,3.24
D4  (via drill 0.4)
  Top 0.254: U$14.31 35.63,14.3 35.94,14.61 v36.45,14.61
  Bottom 0.254: JP1.1 43.56,1.27 42.39,2.44 40.62,2.44 38.1,4.95 38.1,13.02 36.51,14.61 v36.45,14.61
D5
  Top 0.254: JP3.10 39.37,21.21 38.42,21.21 37.63,20.42 36.28,20.42 35.8,19.94 33.51,19.94 33.12,19.55 33.12,17.71 33.38,17.45 33.38,17.1 33.4,17.08 33.38,17.06 33.38,16.84 32.91,16.37 U$14.35
D6
  Top 0.254: U$14.37 31.91,17.64 32.63,18.36 32.63,19.75 33.3,20.42 35.09,20.42 36.26,21.59 JP3.9
D8_NEOPIX  (via drill 0.39, 0.4)
  Top 0.254: 17.31,6.64 v17.27,6.6 17.27,7.77 LED1.1 | U$14.64 v24.65,7.3 v24.64,7.31
  Bottom 0.254: v17.27,6.6 v17.27,6.61 17.27,4.95 18.09,4.13 21.45,4.13 v24.64,7.31
D9
  Top 0.254: U$14.38 31.41,17.82 32.15,18.55 32.15,19.96 33.78,21.59 JP3.8
D10
  Top 0.254: JP3.7 29.91,19.75 U$14.41
D11
  Top 0.254: U$14.42 29.41,19.32 29.21,19.53 JP3.6
D12
  Top 0.254: U$14.43 28.91,19.14 26.67,21.38 JP3.5
D13  (via drill 0.39)
  Top 0.254: U$14.44 28.41,18.96 26.95,20.42 26.19,20.42 25.5,21.11 25.02,21.59 JP3.4 | R7.1 5.36,22.16 v4.57,22.16
  Bottom 0.254: JP3.4 21.84,19.3 20.77,19.3 14.03,19.3 12.64,17.91 10.99,17.91 6.73,22.16 v4.57,22.16
D+  (via drill 0.39, 0.4)
  Top 0.254: X3.D+ 5.97,11.43 6.48,10.92 6.48,10.41 v6.67,10.41 | v27.1,17.96 27.41,17.65 U$14.46
  Bottom 0.254: v27.1,17.96 26.78,18.29 14.48,18.29 6.67,10.48 v6.67,10.41 D+.TP
D-  (via drill 0.39, 0.4)
  Top 0.254: 6.46,12.08 v6.67,11.87 | U$14.45 27.91,18.19 27.05,19.05 v26.99,19.05
  Top 0.305: X3.D- 6.46,12.08
  Bottom 0.254: v26.99,19.05 26.73,18.8 14.29,18.8 7.37,11.87 v6.67,11.87 6.1,12.45 D-.TP
EN  (via drill 0.39)
  Top 0.254: U2.3 16.03,9.97 16.38,9.97 | 16.38,9.97 16.48,10.07 R3.1 | v20.19,16.7 20.19,19.18 19.05,20.32 JP3.2 | 16.38,9.97 16.38,9.14 v16.64,8.89
  Bottom 0.254: v16.64,8.89 16.64,9.08 18.61,11.05 18.61,15.81 19.49,16.7 v20.19,16.7
GND  (via drill 0.39, 0.4, 1.1 pad 1.78)
  Top 0.254: C8.2 15.68,13.6 | C2.2 19.32,5.92 19.56,6.16 | C2.2 18.87,5.92 | C13.2 18.8,9.24 C11.2 | U$14.47 26.91,16.65 | U$14.33 33.91,14.31 33.92,14.3 33.92,14.03 | C2.2 20.24,5.92 C4.2 | U$14.7 29.41,5.86 C10.2
  Top 0.305: R9.3 23.89,17.61 C7.2
  Top 0.406: v40.64,4.45 38.04,4.45 37.97,4.51
  Bottom 0.406: v45.72,4.45 v43.18,4.45 v40.64,4.45
  other vias: 9.72,7.62 13.87,8.41 17.91,8.95 14.22,16.32 8.38,15.18 7.24,8.57 17.78,20.83 8.89,21.72 12.64,21.78 23.43,19.68 20.19,14.35 9.84,12.26 17.78,15.11 22.86,11.75 20.38,11.81 30.16,9.21 28.38,12.83 28.45,10.99 28.45,9.21 30.35,10.67 31.94,12.83 26.1,17.53 30.29,14.54 33.66,12.51 26.86,7.81 37.34,19.24 35.12,3.17 35.69,15.43 37.27,10.6 36.45,17.21
  pour Top: 0,22.86 0,0 45.72,0 45.72,2.79 38.1,2.79 38.1,22.86
  pour Bottom: 38.1,0 0,0 0,22.86 38.1,22.86
MISO  (via drill 0.4)
  Top 0.254: U$14.49 25.27,15.24 v25.27,15.53
  Bottom 0.254: JP1.4 35.94,1.27 34.77,2.44 33.82,2.44 31.85,4.41 31.85,11.63 28.98,14.51 25.92,14.51 25.27,15.15 v25.27,15.53
MOSI  (via drill 0.4)
  Top 0.254: U$14.50 25.29,14.3 25.01,14.02 v24.72,14.02
  Bottom 0.254: v24.72,14.02 28.77,14.02 31.37,11.43 31.37,4.19 JP1.5
N$1
  Top 0.254: 3.85,5.59 CHG.C 4.8,4.25 R2.1
N$2
  Top 0.254: L.A 5.71,19.38 R7.2
N$3  (via drill 0.39)
  Top 0.254: 6.1,5.4 v6.1,5.46 6.1,4.84 R2.2 | U3.1 17.4,14.41 v16.76,15.05
  Bottom 0.254: v6.1,5.46 6.22,5.46 8.51,7.75 8.51,9.14 14.48,15.11 16.7,15.11 v16.76,15.05
N$4
  Top 0.254: R8.1 17.57,16.41 U3.5
N$5
  Top 0.203: 21.53,5.59 21.53,7.18 23.05,7.18 23.24,6.99
  Top 0.254: U$14.1 24.96,6.6 24.94,6.58 23.65,6.58 23.24,6.99 | 21.53,5.59 21.53,5.42 X2.P$1 20.33,4.22 C2.1
N$6  (via drill 1.1 pad 1.78)
  other vias: 49.53,16.51
N$7
  Top 0.254: U$14.2 26.91,6.11 26.65,5.84 23.89,5.84 23.01,4.96 X2.P$2 23.01,5.72 C4.1
N$8  (via drill 1.1 pad 1.78)
  other vias: 46.99,16.51
N$9  (via drill 1.1 pad 1.78)
  other vias: 44.45,16.51
N$10  (via drill 1.1 pad 1.78)
  other vias: 41.91,16.51
N$11
  Top 0.254: U$14.55 24.09,11.8 22.96,10.67 21.1,10.67 L2.P$2
N$12  (via drill 1.1 pad 1.78)
  other vias: 39.37,16.51
N$13  (via drill 1.1 pad 1.78)
  other vias: 39.37,13.97
N$14  (via drill 1.1 pad 1.78)
  other vias: 39.37,11.43
N$15  (via drill 1.1 pad 1.78)
  other vias: 39.37,8.89
N$16  (via drill 1.1 pad 1.78)
  other vias: 41.91,6.35
N$17  (via drill 1.1 pad 1.78)
  other vias: 41.91,8.89
N$18  (via drill 1.1 pad 1.78)
  other vias: 41.91,11.43
N$19  (via drill 1.1 pad 1.78)
  other vias: 44.45,11.43
N$20  (via drill 1.1 pad 1.78)
  other vias: 44.45,13.97
N$21  (via drill 1.1 pad 1.78)
  other vias: 41.91,13.97
N$22  (via drill 1.1 pad 1.78)
  other vias: 46.99,13.97
N$23  (via drill 1.1 pad 1.78)
  other vias: 49.53,13.97
N$24  (via drill 1.1 pad 1.78)
  other vias: 49.53,11.43
N$25  (via drill 1.1 pad 1.78)
  other vias: 46.99,11.43
N$26  (via drill 1.1 pad 1.78)
  other vias: 44.45,8.89
N$27  (via drill 1.1 pad 1.78)
  other vias: 46.99,8.89
N$28  (via drill 1.1 pad 1.78)
  other vias: 49.53,8.89
N$29  (via drill 1.1 pad 1.78)
  other vias: 49.53,6.35
N$30  (via drill 1.1 pad 1.78)
  other vias: 46.99,6.35
N$31  (via drill 1.1 pad 1.78)
  other vias: 44.45,6.35
N$32  (via drill 1.1 pad 1.78)
  other vias: 39.37,6.35
QSPI_CS  (via drill 0.4)
  Top 0.254: U$14.24 35.95,10.8 v36.2,11.05 | v37.34,6.16 36.89,6.6 36,6.6 35.76,6.84 U1.1 | v37.34,6.16 | R5.1 37.34,5.02 v37.34,6.16
  Bottom 0.254: v37.34,6.16 37.34,5.52 36.89,5.08 36.01,5.08 35.43,5.65 35.43,9.97 36.2,10.73 v36.2,11.05
QSPI_DATA[0]  (via drill 0.4)
  Top 0.254: U$14.17 34.61,6.79 35.56,5.84 v36.33,5.84 | U1.5 37.26,8.75 v37.15,8.64
  Bottom 0.254: v37.15,8.64 36.33,7.82 v36.33,5.84
QSPI_DATA[1]
  Top 0.254: U1.2 36.26,7.68 36.13,7.82 34.63,7.82 U$14.18
QSPI_DATA[2]
  Top 0.254: U$14.19 36.41,8.3 36.77,7.94 36.76,7.93 U1.3
QSPI_DATA[3]
  Top 0.254: U$14.20 35.28,8.8 35.5,9.02 35.51,9.02 36.01,9.02 36.26,9.27 36.26,9.34 U1.7
QSPI_SCK
  Top 0.254: U1.6 36.74,9.65 36.74,10.04 36.49,10.3 U$14.23
RX_D0  (via drill 0.4)
  Top 0.254: v30.73,18.86 30.41,18.54 U$14.40
  Bottom 0.254: v30.73,18.86 33.27,18.86 34.42,17.72 34.42,5.27 37.15,2.54 37.47,2.54 38.73,1.27 JP1.3
SCK  (via drill 0.4)
  Top 0.254: U$14.36 32.41,16.73 32.65,16.96 v32.65,17.14 | v34.11,3.58 33.87,3.58 31.75,1.46 JP1.6
  Bottom 0.254: v32.65,17.14 32.88,16.91 32.88,12.37 32.87,12.37 32.33,11.83 32.33,4.61 33.36,3.58 v34.11,3.58
SCL
  Top 0.254: U$14.30 37.12,13.8 37.55,14.23 37.55,16.64 37.55,18.17 39.8,20.42 39.87,20.42 39.89,20.45 41.15,20.45 41.91,21.21 JP3.11
SDA
  Top 0.254: U$14.29 37.3,13.3 38.04,14.03 38.04,17.97 40.01,19.94 43.56,19.94 44.45,20.83 JP3.12
SWCLK  (via drill 0.39)
  Top 0.254: U$14.57 24.58,10.8 23.11,9.34 v23.11,9.21 23.11,8.93 R6.2
  Bottom 0.254: TP1.P$1 20.13,6.79 21.21,6.79 23.11,8.7 v23.11,9.21
SWDIO  (via drill 0.39)
  Top 0.254: v23.69,8 23.88,8.19 23.88,9.34 24.84,10.3 U$14.58
  Bottom 0.254: v23.69,8 20.95,5.27 TP2.P$1
TX_D1  (via drill 0.4)
  Top 0.254: U$14.39 30.91,18 31.53,18.62 31.53,19.49 v31.42,19.61
  Bottom 0.254: JP1.2 41.02,1.27 39.18,3.11 37.26,3.11 34.9,5.47 34.9,17.92 33.47,19.34 31.68,19.34 v31.42,19.61
V_DIV  (via drill 0.39)
  Top 0.254: R9.2 R9.1 24.26,15.17 v24.26,15.05 | U$14.62 25.23,8.3 v24.64,8.89
  Bottom 0.254: v24.64,8.89 24.57,8.95 24.57,13.14 24.43,13.29 24.41,13.29 23.98,13.72 23.98,14.33 24.26,14.6 v24.26,15.05
VBAT
  Top 0.203: 18.41,18.8 18.41,17.21
  Top 0.305: 11.79,15.56 11.79,14.27 10.73,13.21 10.73,11.29 10.29,10.84 Q3.3 | 11.79,15.56 X1.2 | 18.41,18.8 17.97,19.24 16.7,19.24 16.51,19.43 | 22.07,15.91 R9.8 21.37,15.91 20.77,15.3 19.37,15.3 | 19.37,15.3 18.86,15.3 18.41,15.75 18.41,17.21 | JP3.1 16.51,19.43 | 16.51,19.43 16.51,18.98 C3.1 14.48,18.22 11.81,15.56 11.79,15.56 | U3.3 19.37,13.88 19.37,15.3
VBUS  (via drill 0.39)
  Top 0.305: 7.3,12.73 X3.VBUS 5.19,12.7 4.25,12.7 4,12.45 4,10.16 3.43,9.59 1.33,9.59 0.89,9.14 0.89,6.06 CHG.A 1.36,5.69 | 7.3,12.73 7.58,12.73 7.99,12.32 D4.A 8.45,12.27 Q3.1 | v12.51,19.11 12.26,18.86 9.34,18.86 7.37,16.89 7.37,12.79 7.3,12.73 | U3.4 19.3,16.39 19.78,15.91 20.5,15.91 20.99,16.4 20.99,17.37 21.23,17.61 R9.6 22.56,17.61 22.67,17.72 22.67,20.51 JP3.3
  Bottom 0.305: v12.51,19.11 13.21,19.81 19.81,19.81 JP3.3
VDDCORE1
  Top 0.254: 22.1,13.08 22.64,12.54 23.73,12.54 23.99,12.8 U$14.53 | 22.1,13.08 21.23,13.08 L2.P$1 21.07,12.95 20.26,12.95 19.55,12.25 C13.1 | 22.99,14.33 C15.1 22.1,13.44 22.1,13.08
VHI
  Top 0.254: U2.1 13.78,10.48 | 13.78,10.48 14.22,10.92 16.07,10.92 16.92,11.77 R3.2 | Q3.2 10.35,9.09 C6.1 | 13.78,10.48 12.35,10.48 C6.1 | D4.C 12.2,10.95 C6.1